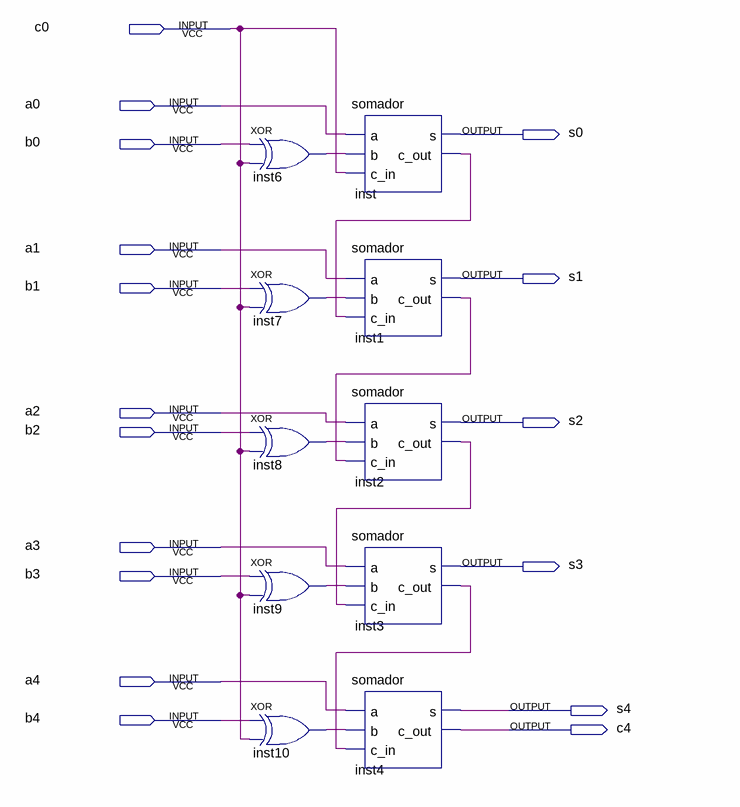
[diagram p0: schematic sheet]
// Quartus schematic somador5bits.bdf as structural Verilog: 10 symbols, 17 pins
module somador5bits (
  input  c0,
  input  a0,
  input  b0,
  input  a1,
  input  b1,
  input  a2,
  input  b2,
  input  a3,
  input  b3,
  input  a4,
  input  b4,
  output s0,
  output s1,
  output s2,
  output s3,
  output s4,
  output c4
);

  wire inst1_c_out, inst2_c_out, inst3_c_out, inst6_out, inst7_out, inst8_out, inst9_out, inst10_out,
       inst_c_out;

  xor inst6 (inst6_out, b0, c0);
  xor inst7 (inst7_out, b1, c0);
  xor inst8 (inst8_out, b2, c0);
  xor inst9 (inst9_out, b3, c0);
  xor inst10 (inst10_out, b4, c0);
  somador inst (.a(a0), .b(inst6_out), .c_in(c0), .s(s0), .c_out(inst_c_out));
  somador inst1 (.a(a1), .b(inst7_out), .c_in(inst_c_out), .s(s1), .c_out(inst1_c_out));
  somador inst2 (.a(a2), .b(inst8_out), .c_in(inst1_c_out), .s(s2), .c_out(inst2_c_out));
  somador inst3 (.a(a3), .b(inst9_out), .c_in(inst2_c_out), .s(s3), .c_out(inst3_c_out));
  somador inst4 (.a(a4), .b(inst10_out), .c_in(inst3_c_out), .s(s4), .c_out(c4));
endmodule
